# EAGLE schematic bms (EAGLE 9.2.2)
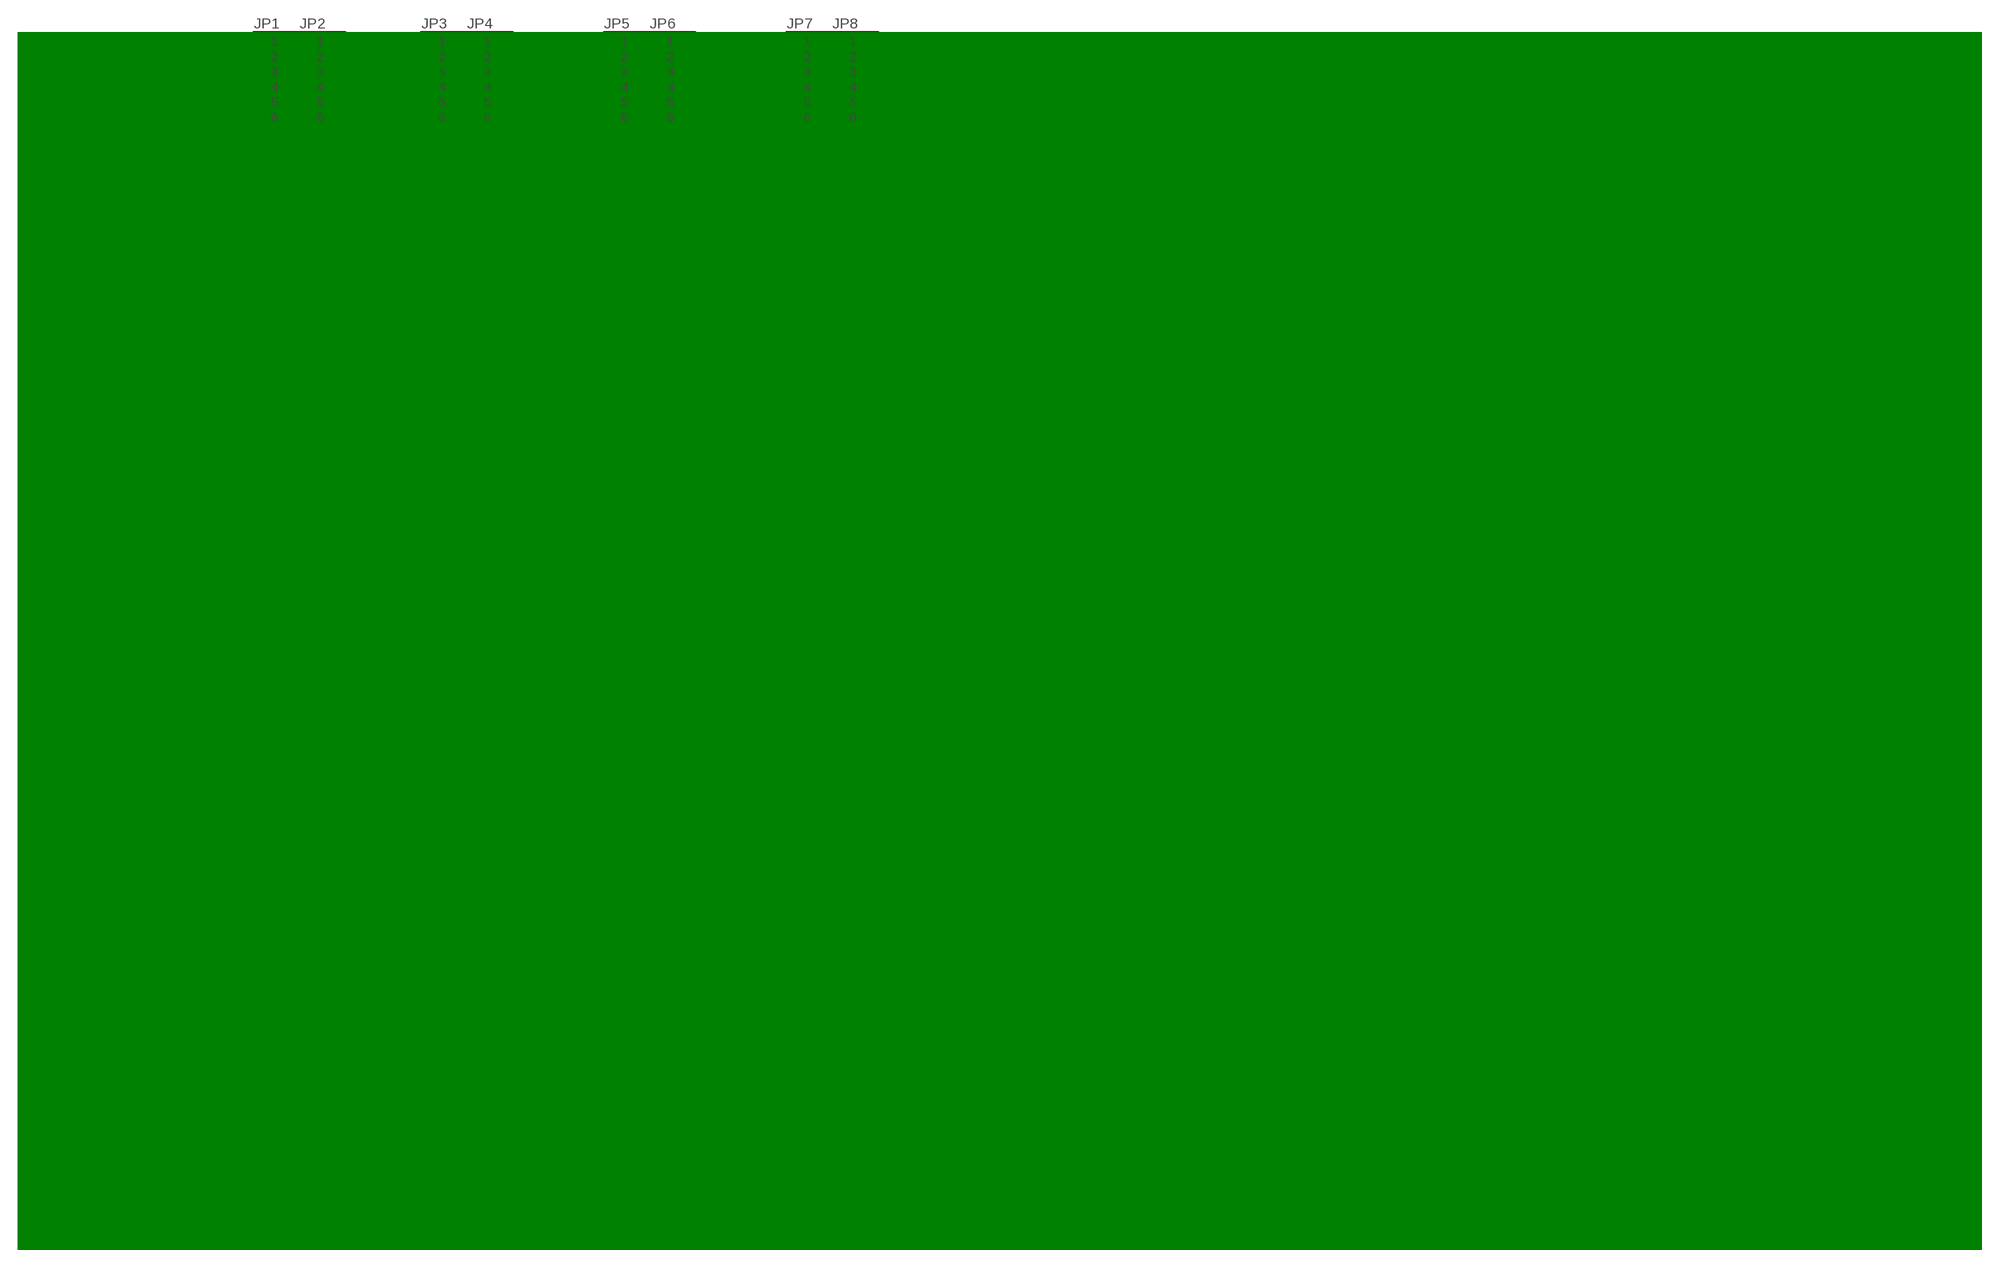
[diagram p0: schematic, sheet 1]

## Parts
JP1  PINHD-1X6  [1X06]
JP2  PINHD-1X6  [1X06]
JP3  PINHD-1X6  [1X06]
JP4  PINHD-1X6  [1X06]
JP5  PINHD-1X6  [1X06]
JP6  PINHD-1X6  [1X06]
JP7  PINHD-1X6  [1X06]
JP8  PINHD-1X6  [1X06]
Unconnected: JP1.1 JP1.2 JP1.3 JP1.4 JP1.5 JP1.6 JP2.1 JP2.2 JP2.3 JP2.4 JP2.5 JP2.6 JP3.1 JP3.2 JP3.3 JP3.4 JP3.5 JP3.6 JP4.1 JP4.2 JP4.3 JP4.4 JP4.5 JP4.6 JP5.1 JP5.2 JP5.3 JP5.4 JP5.5 JP5.6 JP6.1 JP6.2 JP6.3 JP6.4 JP6.5 JP6.6 JP7.1 JP7.2 JP7.3 JP7.4 JP7.5 JP7.6 JP8.1 JP8.2 JP8.3 JP8.4 JP8.5 JP8.6

## Library data of the parts
JP1-JP8 = pinhead:PINHD-1X6: PIN HEADER